# EAGLE design Daughterboard (EAGLE 6.3)
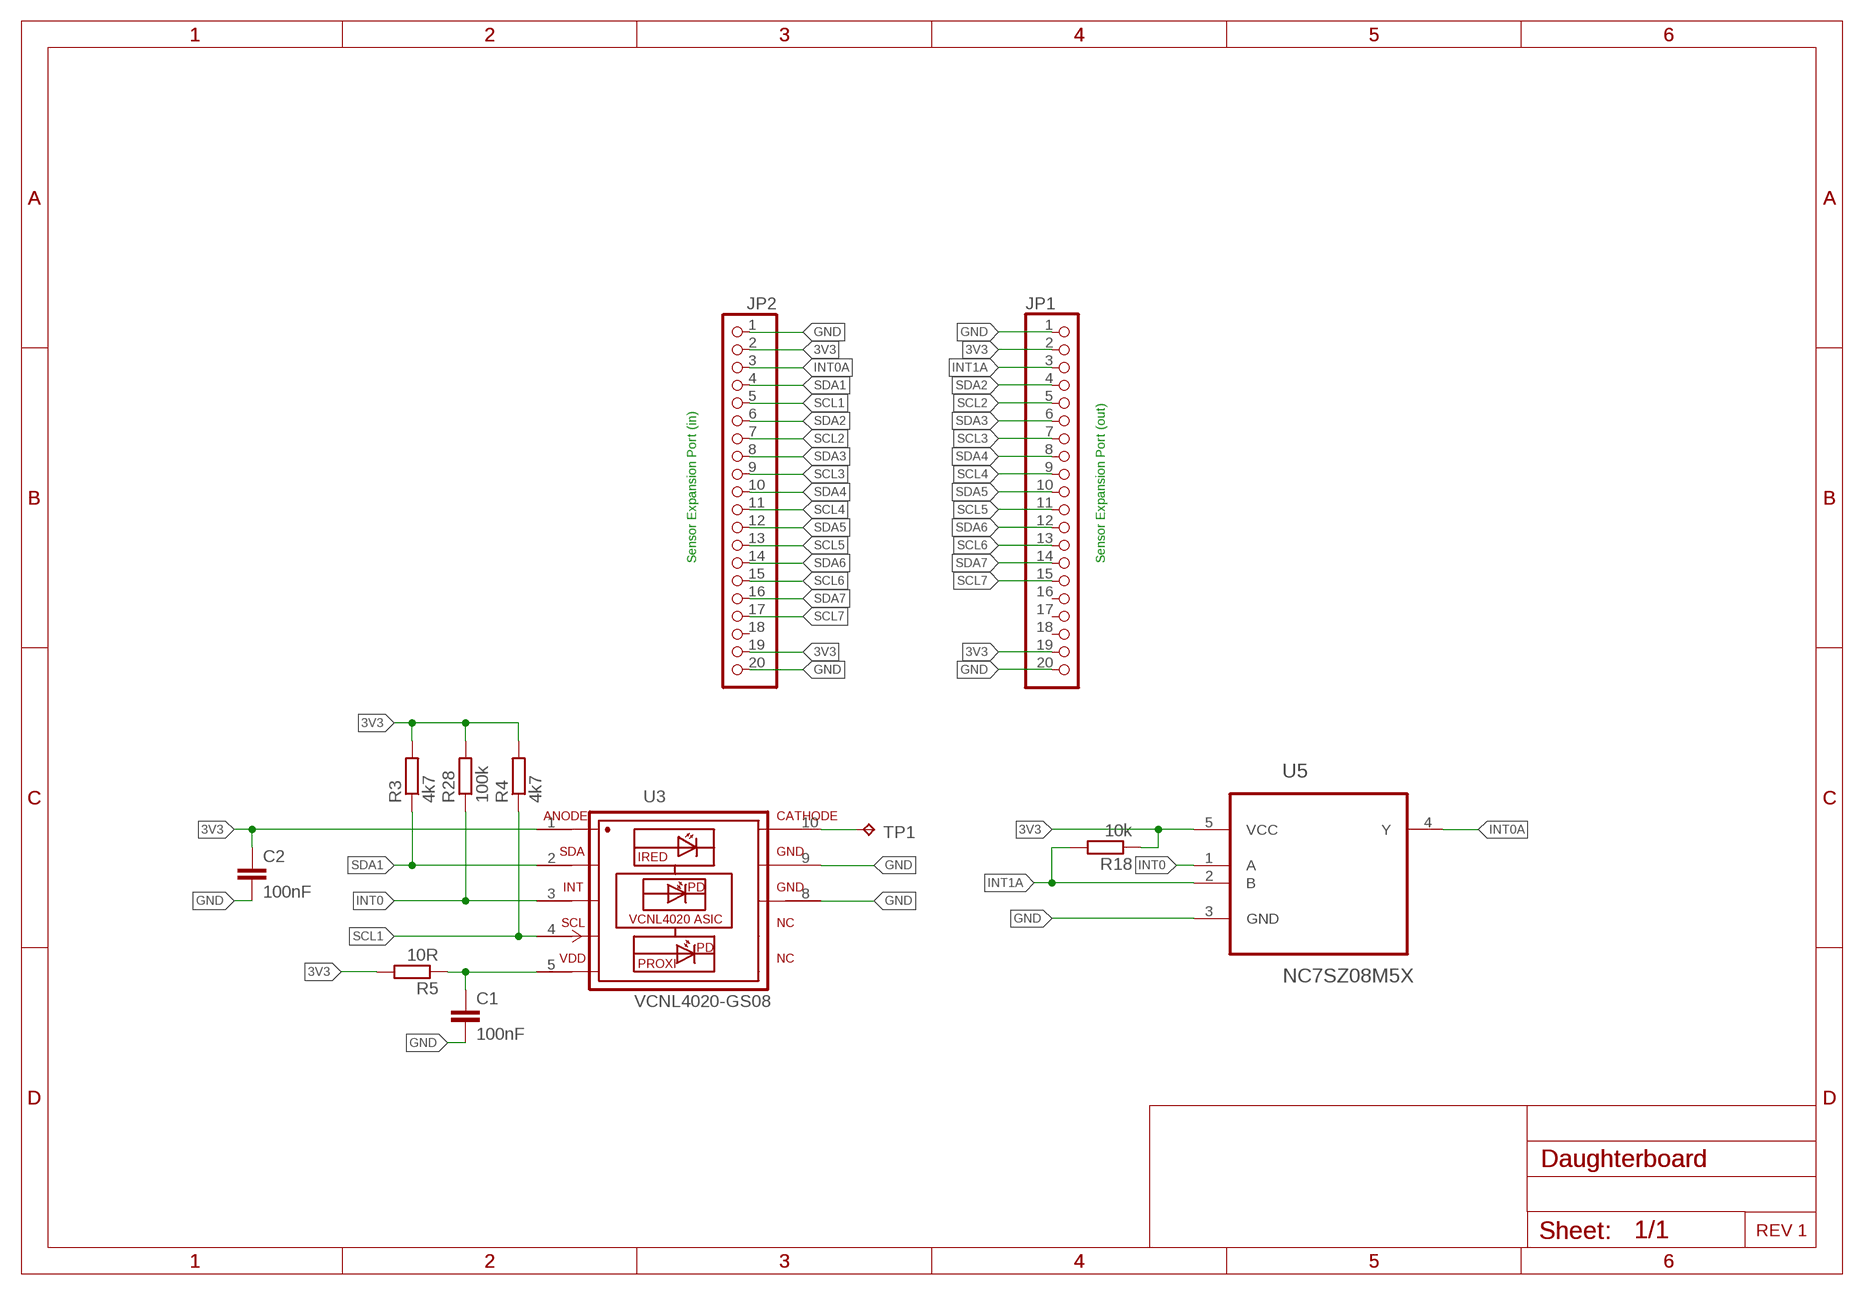
[diagram p0: schematic, sheet 1]

## Parts
C1  100nF  C-EUC0603  [C0603]
C2  100nF  C-EUC0603  [C0603]
JP1  PINHD-1X20/90  [1X20/90]
JP2  PINHD-1X20/90  [1X20/90]
R3  4k7  R-EU_R0603  [R0603]
R4  4k7  R-EU_R0603  [R0603]
R5  10R  R-EU_R0603  [R0603]
R18  10k  R-EU_R0603  [R0603]
R28  100k  R-EU_R0603  [R0603]
TP1  TPB1,27  [B1,27]
U3  VCNL4020-GS08  [PHODET_VCNL4020]
U5  NC7SZ08M5X  [SOT95P280X145-5N]

## Nets
3V3: C2.1 JP1.2 JP1.19 JP2.2 JP2.19 R3.2 R4.2 R5.2 R18.1 R28.2 U3.1(IR-ANODE) U5.5(VCC)
GND: C1.2 C2.2 JP1.1 JP1.20 JP2.1 JP2.20 U3.8(GND2) U3.9(GND) U5.3(GND)
INT0: R28.1 U3.3(INT) U5.1(A)
INT0A: JP2.3 U5.4(Y)
INT1A: JP1.3 R18.2 U5.2(B)
N$1: TP1.TP U3.10(IR-CATHODE)
N$2: C1.1 R5.1 U3.5(VDD)
SCL1: JP2.5 R4.1 U3.4(SCL)
SCL2: JP1.5 JP2.7
SCL3: JP1.7 JP2.9
SCL4: JP1.9 JP2.11
SCL5: JP1.11 JP2.13
SCL6: JP1.13 JP2.15
SCL7: JP1.15 JP2.17
SDA1: JP2.4 R3.1 U3.2(SDA)
SDA2: JP1.4 JP2.6
SDA3: JP1.6 JP2.8
SDA4: JP1.8 JP2.10
SDA5: JP1.10 JP2.12
SDA6: JP1.12 JP2.14
SDA7: JP1.14 JP2.16
Unconnected: JP1.16 JP1.17 JP1.18 JP2.18

## Notes on the sheet
- Sensor Expansion Port (in) | Sensor Expansion Port (out)
- REV 1

## Library data of the parts
C1 C2 = rcl:C-EU: CAPACITOR, European symbol
JP1 JP2 = pinhead:PINHD-1X20: PIN HEADER
R3-R5 R18 R28 = rcl:R-EU_: RESISTOR, European symbol
TP1 = testpad:TP: Test pad
U3 = VCNL4020-GS08:VCNL4020-GS08: VCNL4020 Fully Integrated Proximity and Ambient Light Sensor with Infrared Emitter, I2C Interface, and Interrupt Function: The VCNL4020 is a fully integrated proximity and ambient light sensor. Fully integrated means that the infrared emitter is included in the package. It has 16 bit resolution. It includes a signal processing IC and features standard I2C communication interface. It features an interrupt function. Device Model created 15.06.2016 by Johannes Kolb - Vishay Semiconductor GmbH; AVAILABILITY: Unavailable; DESCRIPTION: VCNL4020 Series 2.5 - 3.6 V 200 mm Range SMT Proximity and Ambient Light Sensor; MF: Vishay Semiconductor; MP: VCNL4020-GS08; PACKAGE: VDFN-10 Vishay; PRICE: None
U5 = NC7SZ08M5X:NC7SZ08M5X: Tiny logic UHS Two Input AND Gate; DIGI-KEY_PART_NUMBER: NC7SZ08M5XCT-ND; DIGI-KEY_PURCHASE_URL: https://www.digikey.com/product-detail/en/on-semiconductor/NC7SZ08M5X/NC7SZ08M5XCT-ND/673390?utm_source=snapeda&utm_medium=aggregator&utm_campaign=symbol; MF: ON Semiconductor; MP: NC7SZ08M5X; PACKAGE: SOT-23 Texas Instruments

## Board
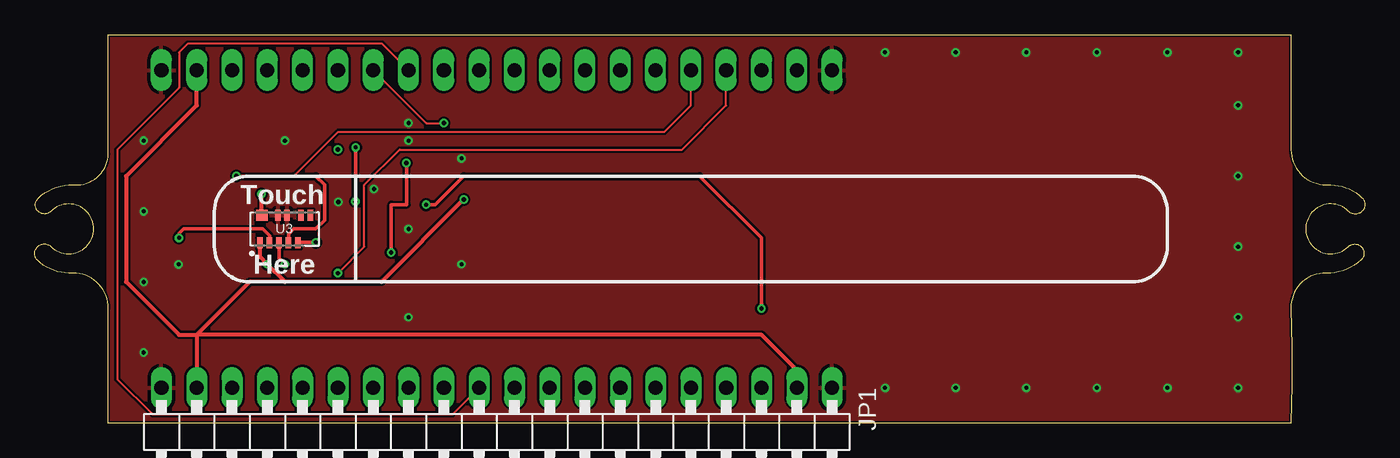
[diagram p1: board, top side]
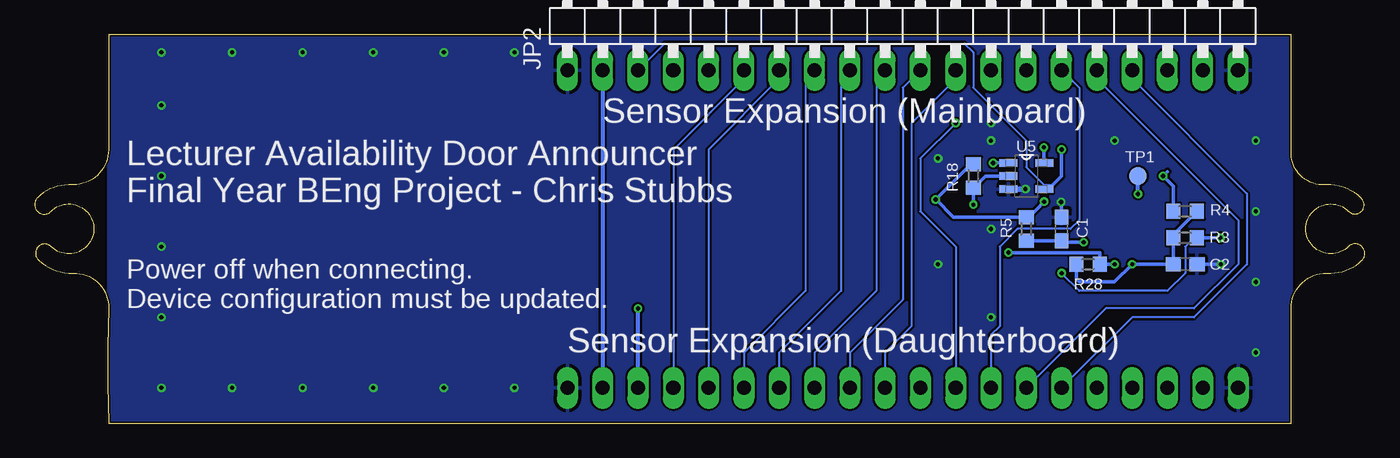
[diagram p2: board, bottom side, seen from below]

Size 95.7 x 27.94 mm. Coordinates in mm from the lower left corner, seen from the top.
Outline: 5.3,0 5.3,8.26 arc90 2.76,10.79 2.45,10.79 arc-45 0.2,11.72 arc-180 1.17,12.7 arc134 4.24,13.97 arc136 1.17,15.24 arc-181 0.25,16.18 arc-46 2.76,17.14 arc4 3.08,17.14 arc86 5.3,19.37 5.3,27.94 90.39,27.94 90.39,19.68 arc90 92.93,17.14 93.25,17.14 arc-45 95.5,16.21 arc-180 94.52,15.24 arc138 91.46,13.9 arc132 94.52,12.7 arc-181 95.44,11.75 arc-45 92.93,10.79 arc94 90.39,8.26 arc-4 90.39,0 5.3,0
Copper layers (1*16): Top 0.035mm / dielectric 1.5mm / Bottom 0.035mm
Design rules "hackvana": minimum track width 6mil, minimum drill 0.3mm, track to track 6mil, track to pad 6mil, pad to pad 6mil, via to via 6mil, smd to smd 0mil, copper to edge 6mil, drill to drill 6mil, minimum pad ring 10mil, minimum via ring 6mil, stop-mask expansion 2mil, vias tented up to drill 100mil, thermal gap 10mil

### Footprints (pad centres in the part's own frame; a part is rotated, then mirrored left to right if it is on the bottom)
C0603 = smd 1.1 x 1: 1 -0.85,0; 2 0.85,0
1X20/90 = drill 1.016 long: 1 -24.13,-3.81; 2 -21.59,-3.81; 3 -19.05,-3.81; 4 -16.51,-3.81; 5 -13.97,-3.81; 6 -11.43,-3.81; 7 -8.89,-3.81; 8 -6.35,-3.81; 9 -3.81,-3.81; 10 -1.27,-3.81; 11 1.27,-3.81; 12 3.81,-3.81; 13 6.35,-3.81; 14 8.89,-3.81; 15 11.43,-3.81; 16 13.97,-3.81; 17 16.51,-3.81; 18 19.05,-3.81; 19 21.59,-3.81; 20 24.13,-3.81
R0603 = smd 1 x 1.1: 1 -0.85,0; 2 0.85,0
B1,27 = smd 1.27 x 1.27: TP 0,0
PHODET_VCNL4020 = smd 0.8 x 0.4: 1 -1,1.8; 2 -1,1.115; 3 -1,0.43; 4 -1,-0.255; 5 -1,-0.94; 6 1,-1.83; 7 1,-1.15; 8 1,-0.15; 9 1,0.5 | smd 0.8 x 0.83: 10 1,1.665
SOT95P280X145-5N = smd 1.27 x 0.559: 1 -1.295,0.94; 2 -1.295,0; 3 -1.295,-0.94; 4 1.295,-0.94; 5 1.295,0.94

### Placement (x,y rotation side)
C1  21.81,13.97 90 bottom
C2  12.92,11.43 0 bottom
JP1  33.24,-1.27 180 top
JP2  33.24,29.21 0 bottom
R3  12.92,13.34 180 bottom
R4  12.92,15.24 0 bottom
R5  24.35,13.97 90 bottom
R18  28.16,17.78 270 bottom
R28  19.91,11.43 180 bottom
TP1  16.32,17.78 0 bottom
U3  18,13.97 90 top
U5  24.35,17.78 0 bottom

### Tracks (layer width: path | path; a pad name or v marks a point on that pad's centre or on a via)
3V3  (via drill 0.3)
  Top 0.254: v23.07,15.94 v23.09,19.84
  Top 0.305: v30.87,16.09 24.94,10.16 18,10.16 | 18,10.16 v16.73,11.43 16.2,11.96 U3.1 | 18,10.16 15.46,10.16 11.65,6.35 | 11.65,6.35 JP1.19 | JP1.2 54.83,3.81 52.29,6.35 11.65,6.35 | 11.65,6.35 10.38,6.35 6.57,10.16 6.57,17.78 11.65,22.86 JP2.19
  Bottom 0.254: v30.87,16.09 29.6,14.82 R5.2 24.13,14.82 v23.07,15.94 | R4.2 13.77,13.54 R3.2 C2.1 v16.73,11.43 18,10.16 20.54,10.16 20.76,10.38 R28.2 | v23.09,19.84 23.09,18.75 U5.5 | R18.1 28.33,18.63 v30.87,16.09 | 31.02,15.94 v30.87,16.09
  Bottom 0.305: JP2.2 JP1.2
GND  (via drill 0.3)
  Bottom 0.254: C2.2 v10.35,11.42 | C1.2 21.81,16 v21.84,15.91
  Bottom 0.406: U5.3 v24.41,16.84 v24.41,16.85
  other vias: 86.58,17.78 86.58,12.7 86.58,7.62 86.58,2.54 81.5,2.54 76.42,2.54 71.34,2.54 66.26,2.54 61.18,2.54 7.84,5.08 7.84,10.16 7.84,15.24 7.84,20.32 86.58,22.86 86.58,26.67 81.5,26.67 76.42,26.67 71.34,26.67 66.26,26.67 61.18,26.67 18,20.32 26.89,20.32 26.89,13.97 26.89,7.62 30.7,11.43 26.89,21.59 30.7,19.05
  pour Top: 5.3,0 90.39,0 90.39,27.94 5.3,27.94
  pour Bottom: 5.3,0 90.39,0 90.39,27.94 5.3,27.94
INT0  (via drill 0.3)
  Top 0.254: U3.3 17.57,11.86 v18,11.43 | v25.65,12.28 25.65,15.72 26.76,15.72 26.76,18.72 v26.74,18.72
  Bottom 0.254: v18,11.43 R28.1 19.06,12.28 v25.65,12.28 | v26.74,18.72 U5.1
INT0A  (via drill 0.3)
  Bottom 0.152: 22.45,17.14 23.08,17.14 24.35,18.41 24.35,20.32 28.16,24.13 28.16,26.67 28.8,27.3 50.39,27.3 JP2.3
  Bottom 0.254: U5.4 22.75,16.84 22.45,17.14 21.81,17.78 v21.81,19.68
INT1A  (via drill 0.3)
  Top 0.254: v28.16,15.72 28.8,15.72 30.86,17.78 47.85,17.78 52.29,13.34 v52.29,8.26
  Bottom 0.254: U5.2 27.31,17.78 R18.2 v28.16,15.72
  Bottom 0.305: JP1.3 v52.29,8.26
N$1  (via drill 0.3)
  Top 0.305: U3.10 16.32,14.99 v16.32,16.49
  Bottom 0.305: v16.32,16.49 TP1.TP
N$2  (via drill 0.3)
  Top 0.254: U3.5 18.99,13.02 v20.22,13.02
  Bottom 0.254: v20.22,13.02 21.71,13.02 arc90 C1.1 R5.1
SCL1  (via drill 0.3)
  Top 0.152: 18.64,17.78 21.81,20.95 45.31,20.95 47.21,22.86 JP2.5
  Top 0.254: v14.51,17.78 18.64,17.78 20.22,17.78 20.86,17.14 20.86,14.61 20.22,13.97 18.64,13.97 18.26,13.59 U3.4
  Bottom 0.254: R4.1 13.77,17.04 v14.51,17.78 14.19,18.1
SCL2
  Bottom 0.152: JP1.5 47.21,19.68 42.13,24.77 JP2.7
SCL3
  Bottom 0.152: JP1.7 42.13,5.08 37.69,9.53 37.69,24.77 JP2.9
SCL4
  Bottom 0.152: JP1.9 37.05,5.08 33.24,8.89 33.24,24.13 JP2.11
SCL5
  Top 0.152: JP1.11 30.07,0.64 8.48,0.64 5.94,3.17 5.94,19.68 10.38,24.13 10.38,26.67 11.02,27.3 24.99,27.3 JP2.13
SCL6
  Bottom 0.152: JP1.13 26.89,6.35 26.26,6.99 26.26,12.7 24.99,13.97 21.18,13.97 20.54,14.61 20.54,24.13 JP2.15
SCL7
  Bottom 0.152: JP1.15 16.73,7.62 12.29,7.62 8.48,11.43 8.48,16.51 16.73,24.77 JP2.17
SDA1  (via drill 0.3)
  Top 0.152: v21.81,10.79 23.72,12.7 23.72,17.14 26.26,19.68 46.58,19.68 49.75,22.86 JP2.4
  Top 0.254: v10.38,13.34 10.38,13.65 10.7,13.97 16.42,13.97 16.89,13.5 U3.2
  Bottom 0.152: v21.81,10.79 20.54,9.53 14.19,9.53 12.92,10.79 12.92,12.7 12.29,13.34 R3.1
  Bottom 0.254: R3.1 v10.38,13.34
SDA2
  Bottom 0.152: JP1.4 49.75,19.68 44.67,24.77 JP2.6
SDA3
  Bottom 0.152: JP1.6 44.67,5.08 40.23,9.53 40.23,24.77 JP2.8
SDA4
  Bottom 0.152: JP1.8 39.59,5.08 35.15,9.53 35.15,24.77 JP2.10
SDA5
  Bottom 0.152: JP1.10 34.51,5.08 32.61,6.99 32.61,21.59 29.43,24.77 JP2.12
SDA6  (via drill 0.3)
  Top 0.152: v29.43,21.59 28.16,21.59 JP2.14
  Bottom 0.152: JP1.12 29.43,12.7 31.97,15.24 31.97,19.05 v29.43,21.59
SDA7
  Bottom 0.152: JP1.14 18.64,8.26 12.29,8.26 9.11,11.43 9.11,14.61 19.27,24.77 JP2.16

### Text on the board
tPlace: Touch | Here
bPlace: Sensor Expansion (Mainboard) | Lecturer Availability Door Announcer / Final Year BEng Project - Chris Stubbs | Power off when connecting. / Device configuration must be updated. | Sensor Expansion (Daughterboard)